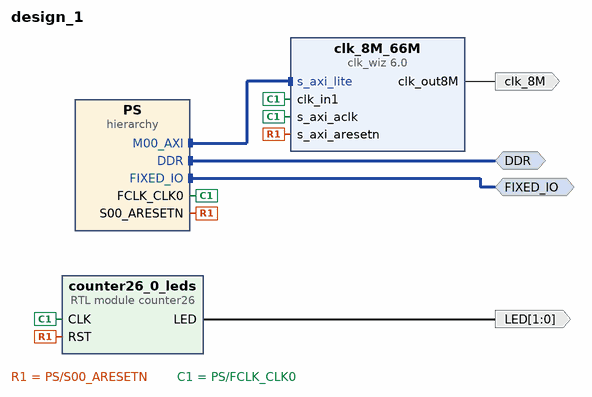
[diagram p0: block diagram of the top level]
# Vivado block design design_1, xc7z010clg400-1, Vivado 2022.1
create_bd_design design_1

create_bd_intf_port -mode Master -vlnv xilinx.com:interface:ddrx_rtl:1.0 DDR
create_bd_intf_port -mode Master -vlnv xilinx.com:display_processing_system7:fixedio_rtl:1.0 FIXED_IO
create_bd_port -dir O -from 1 -to 0 LED
create_bd_port -dir O -type clk clk_8M

create_bd_cell -type module -reference counter26 counter26_0_leds
create_bd_cell -type ip -vlnv xilinx.com:ip:clk_wiz:6.0 clk_8M_66M
set_property -dict [list \
  CONFIG.CLKIN1_JITTER_PS 100.0 \
  CONFIG.CLKOUT1_DRIVES BUFG \
  CONFIG.CLKOUT1_JITTER 218.754 \
  CONFIG.CLKOUT1_PHASE_ERROR 98.575 \
  CONFIG.CLKOUT1_REQUESTED_OUT_FREQ 8 \
  CONFIG.CLKOUT2_DRIVES BUFG \
  CONFIG.CLKOUT2_JITTER 130.958 \
  CONFIG.CLKOUT2_PHASE_ERROR 98.575 \
  CONFIG.CLKOUT2_REQUESTED_OUT_FREQ 8 \
  CONFIG.CLKOUT2_USED false \
  CONFIG.CLKOUT3_DRIVES BUFG \
  CONFIG.CLKOUT4_DRIVES BUFG \
  CONFIG.CLKOUT5_DRIVES BUFG \
  CONFIG.CLKOUT6_DRIVES BUFG \
  CONFIG.CLKOUT7_DRIVES BUFG \
  CONFIG.CLK_OUT1_PORT clk_out8M \
  CONFIG.CLK_OUT2_PORT clk_out8M \
  CONFIG.FEEDBACK_SOURCE FDBK_AUTO \
  CONFIG.MMCM_BANDWIDTH OPTIMIZED \
  CONFIG.MMCM_CLKFBOUT_MULT_F 10.000 \
  CONFIG.MMCM_CLKIN1_PERIOD 10.000 \
  CONFIG.MMCM_CLKIN2_PERIOD 10.000 \
  CONFIG.MMCM_CLKOUT0_DIVIDE_F 125.000 \
  CONFIG.MMCM_CLKOUT1_DIVIDE 1 \
  CONFIG.MMCM_COMPENSATION ZHOLD \
  CONFIG.NUM_OUT_CLKS 1 \
  CONFIG.PRIMITIVE MMCM \
  CONFIG.PRIM_IN_FREQ 100.000 \
  CONFIG.USE_DYN_RECONFIG true \
  CONFIG.USE_RESET true \
] [get_bd_cells clk_8M_66M]
create_bd_cell -type hier PS

# ---- hierarchy /PS ----
current_bd_instance /PS
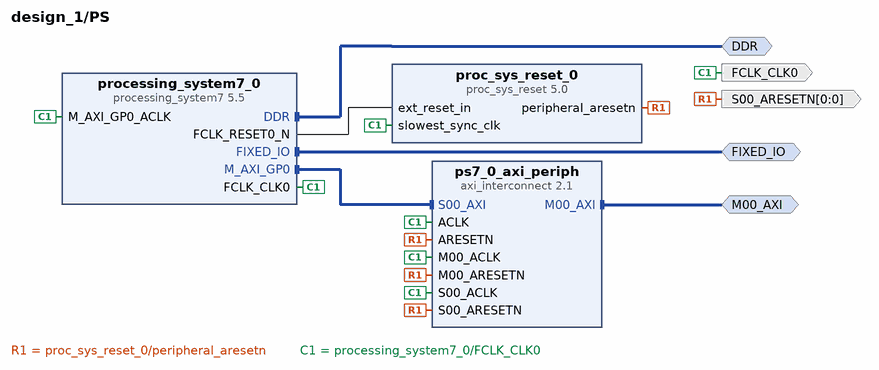
[diagram p1: block diagram inside /PS]
create_bd_intf_pin -mode Master -vlnv xilinx.com:interface:ddrx_rtl:1.0 DDR
create_bd_intf_pin -mode Master -vlnv xilinx.com:display_processing_system7:fixedio_rtl:1.0 FIXED_IO
create_bd_intf_pin -mode Master -vlnv xilinx.com:interface:aximm_rtl:1.0 M00_AXI
create_bd_pin -dir O -type clk FCLK_CLK0
create_bd_pin -dir O -from 0 -to 0 -type rst S00_ARESETN

create_bd_cell -type ip -vlnv xilinx.com:ip:proc_sys_reset:5.0 proc_sys_reset_0
create_bd_cell -type ip -vlnv xilinx.com:ip:processing_system7:5.5 processing_system7_0
set_property -dict [list \
  CONFIG.PCW_ENET0_ENET0_IO EMIO \
  CONFIG.PCW_ENET0_GRP_MDIO_ENABLE 1 \
  CONFIG.PCW_ENET0_GRP_MDIO_IO EMIO \
  CONFIG.PCW_ENET0_PERIPHERAL_ENABLE 1 \
  CONFIG.PCW_ENET0_PERIPHERAL_FREQMHZ {100 Mbps} \
  CONFIG.PCW_ENET_RESET_ENABLE 0 \
  CONFIG.PCW_EN_CLK1_PORT 1 \
  CONFIG.PCW_FCLK_CLK1_BUF TRUE \
  CONFIG.PCW_FPGA0_PERIPHERAL_FREQMHZ 100 \
  CONFIG.PCW_FPGA1_PERIPHERAL_FREQMHZ 1 \
  CONFIG.PCW_FPGA_FCLK1_ENABLE 1 \
  CONFIG.PCW_GPIO_MIO_GPIO_ENABLE 1 \
  CONFIG.PCW_GPIO_MIO_GPIO_IO MIO \
  CONFIG.PCW_I2C_RESET_ENABLE 0 \
  CONFIG.PCW_NAND_NAND_IO {MIO 0 2.. 14} \
  CONFIG.PCW_NAND_PERIPHERAL_ENABLE 1 \
  CONFIG.PCW_SD0_GRP_CD_ENABLE 0 \
  CONFIG.PCW_SD0_GRP_WP_ENABLE 0 \
  CONFIG.PCW_SD0_PERIPHERAL_ENABLE 1 \
  CONFIG.PCW_SD0_SD0_IO {MIO 40 .. 45} \
  CONFIG.PCW_SDIO_PERIPHERAL_FREQMHZ 100 \
  CONFIG.PCW_UART1_PERIPHERAL_ENABLE 1 \
  CONFIG.PCW_UART1_UART1_IO {MIO 24 .. 25} \
  CONFIG.PCW_UART_PERIPHERAL_FREQMHZ 100 \
  CONFIG.PCW_UIPARAM_DDR_BUS_WIDTH {16 Bit} \
  CONFIG.PCW_UIPARAM_DDR_PARTNO {MT41K128M16 JT-125} \
  CONFIG.PCW_USB_RESET_ENABLE 0 \
] [get_bd_cells processing_system7_0]
# 208 more settings of processing_system7_0 are not shown: defaults, MIO pin electricals, DDR timing, and values the tool derives
create_bd_cell -type ip -vlnv xilinx.com:ip:axi_interconnect:2.1 ps7_0_axi_periph
set_property -dict {CONFIG.NUM_MI 1} [get_bd_cells ps7_0_axi_periph]

# ---- connections ----

current_bd_instance /PS
connect_bd_intf_net [get_bd_intf_pins DDR] [get_bd_intf_pins processing_system7_0/DDR]
connect_bd_intf_net [get_bd_intf_pins FIXED_IO] [get_bd_intf_pins processing_system7_0/FIXED_IO]
connect_bd_intf_net [get_bd_intf_pins processing_system7_0/M_AXI_GP0] [get_bd_intf_pins ps7_0_axi_periph/S00_AXI]
connect_bd_intf_net [get_bd_intf_pins M00_AXI] [get_bd_intf_pins ps7_0_axi_periph/M00_AXI]
connect_bd_net [get_bd_pins proc_sys_reset_0/peripheral_aresetn] \
  [get_bd_pins S00_ARESETN] [get_bd_pins ps7_0_axi_periph/S00_ARESETN] [get_bd_pins ps7_0_axi_periph/M00_ARESETN] \
  [get_bd_pins ps7_0_axi_periph/ARESETN]
connect_bd_net [get_bd_pins processing_system7_0/FCLK_CLK0] \
  [get_bd_pins FCLK_CLK0] [get_bd_pins processing_system7_0/M_AXI_GP0_ACLK] [get_bd_pins ps7_0_axi_periph/S00_ACLK] \
  [get_bd_pins ps7_0_axi_periph/M00_ACLK] [get_bd_pins ps7_0_axi_periph/ACLK] [get_bd_pins proc_sys_reset_0/slowest_sync_clk]
connect_bd_net [get_bd_pins processing_system7_0/FCLK_RESET0_N] [get_bd_pins proc_sys_reset_0/ext_reset_in]

current_bd_instance /
connect_bd_intf_net -intf_net processing_system7_0_DDR [get_bd_intf_ports DDR] [get_bd_intf_pins PS/DDR]
connect_bd_intf_net -intf_net processing_system7_0_FIXED_IO [get_bd_intf_ports FIXED_IO] [get_bd_intf_pins PS/FIXED_IO]
connect_bd_intf_net [get_bd_intf_pins PS/M00_AXI] [get_bd_intf_pins clk_8M_66M/s_axi_lite]
connect_bd_net [get_bd_pins clk_8M_66M/clk_out8M] [get_bd_ports clk_8M]
connect_bd_net -net counter26_0_LED [get_bd_pins counter26_0_leds/LED] [get_bd_ports LED]
connect_bd_net -net proc_sys_reset_0_peripheral_aresetn [get_bd_pins PS/S00_ARESETN] \
  [get_bd_pins counter26_0_leds/RST] [get_bd_pins clk_8M_66M/s_axi_aresetn]
connect_bd_net -net processing_system7_0_FCLK_CLK0 [get_bd_pins PS/FCLK_CLK0] \
  [get_bd_pins counter26_0_leds/CLK] [get_bd_pins clk_8M_66M/clk_in1] [get_bd_pins clk_8M_66M/s_axi_aclk]

# ---- address map ----
assign_bd_address -offset 0x43C00000 -range 64K -target_address_space [get_bd_addr_spaces PS/processing_system7_0/Data] [get_bd_addr_segs clk_8M_66M/s_axi_lite/Reg]

validate_bd_design
save_bd_design
